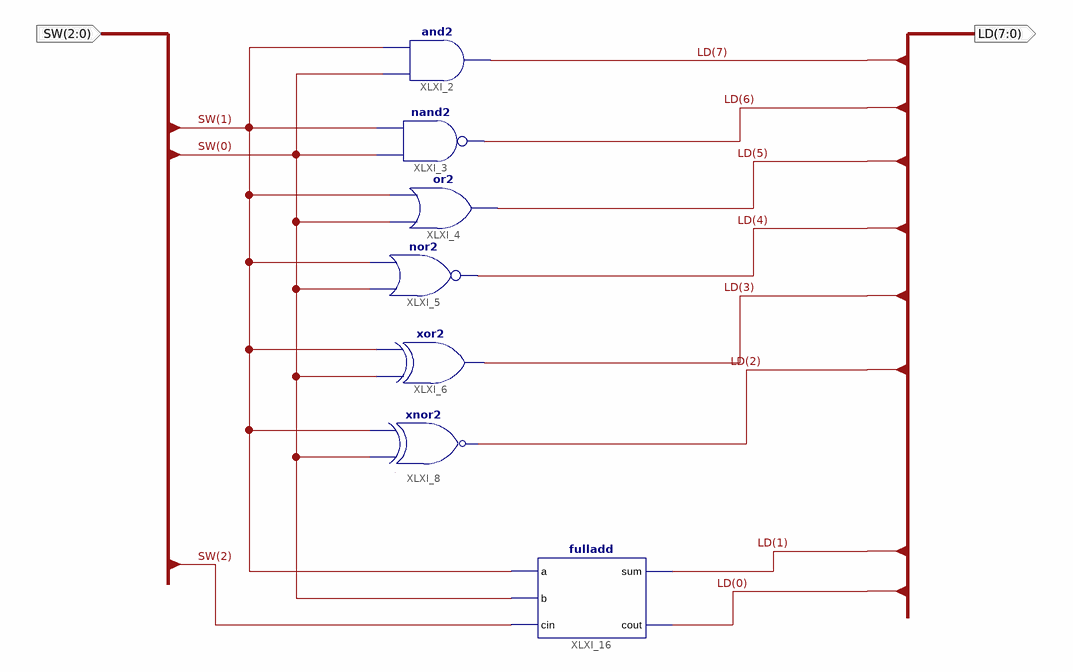
[diagram p0: schematic sheet 1]
// Xilinx ISE schematic lab0.sch (spartan3e) as structural Verilog: 7 symbols, 2 ports
module lab0 (
  input  [2:0] SW,
  output [7:0] LD
);

  and XLXI_2 (LD[7], SW[0], SW[1]);
  nand XLXI_3 (LD[6], SW[0], SW[1]);
  or XLXI_4 (LD[5], SW[0], SW[1]);
  nor XLXI_5 (LD[4], SW[0], SW[1]);
  xor XLXI_6 (LD[3], SW[0], SW[1]);
  xnor XLXI_8 (LD[2], SW[0], SW[1]);
  fulladd XLXI_16 (.a(SW[1]), .b(SW[0]), .cin(SW[2]), .sum(LD[1]), .cout(LD[0]));
endmodule
